# EAGLE design RFM69 USB Gateway 0.8 (EAGLE 7.6.0)
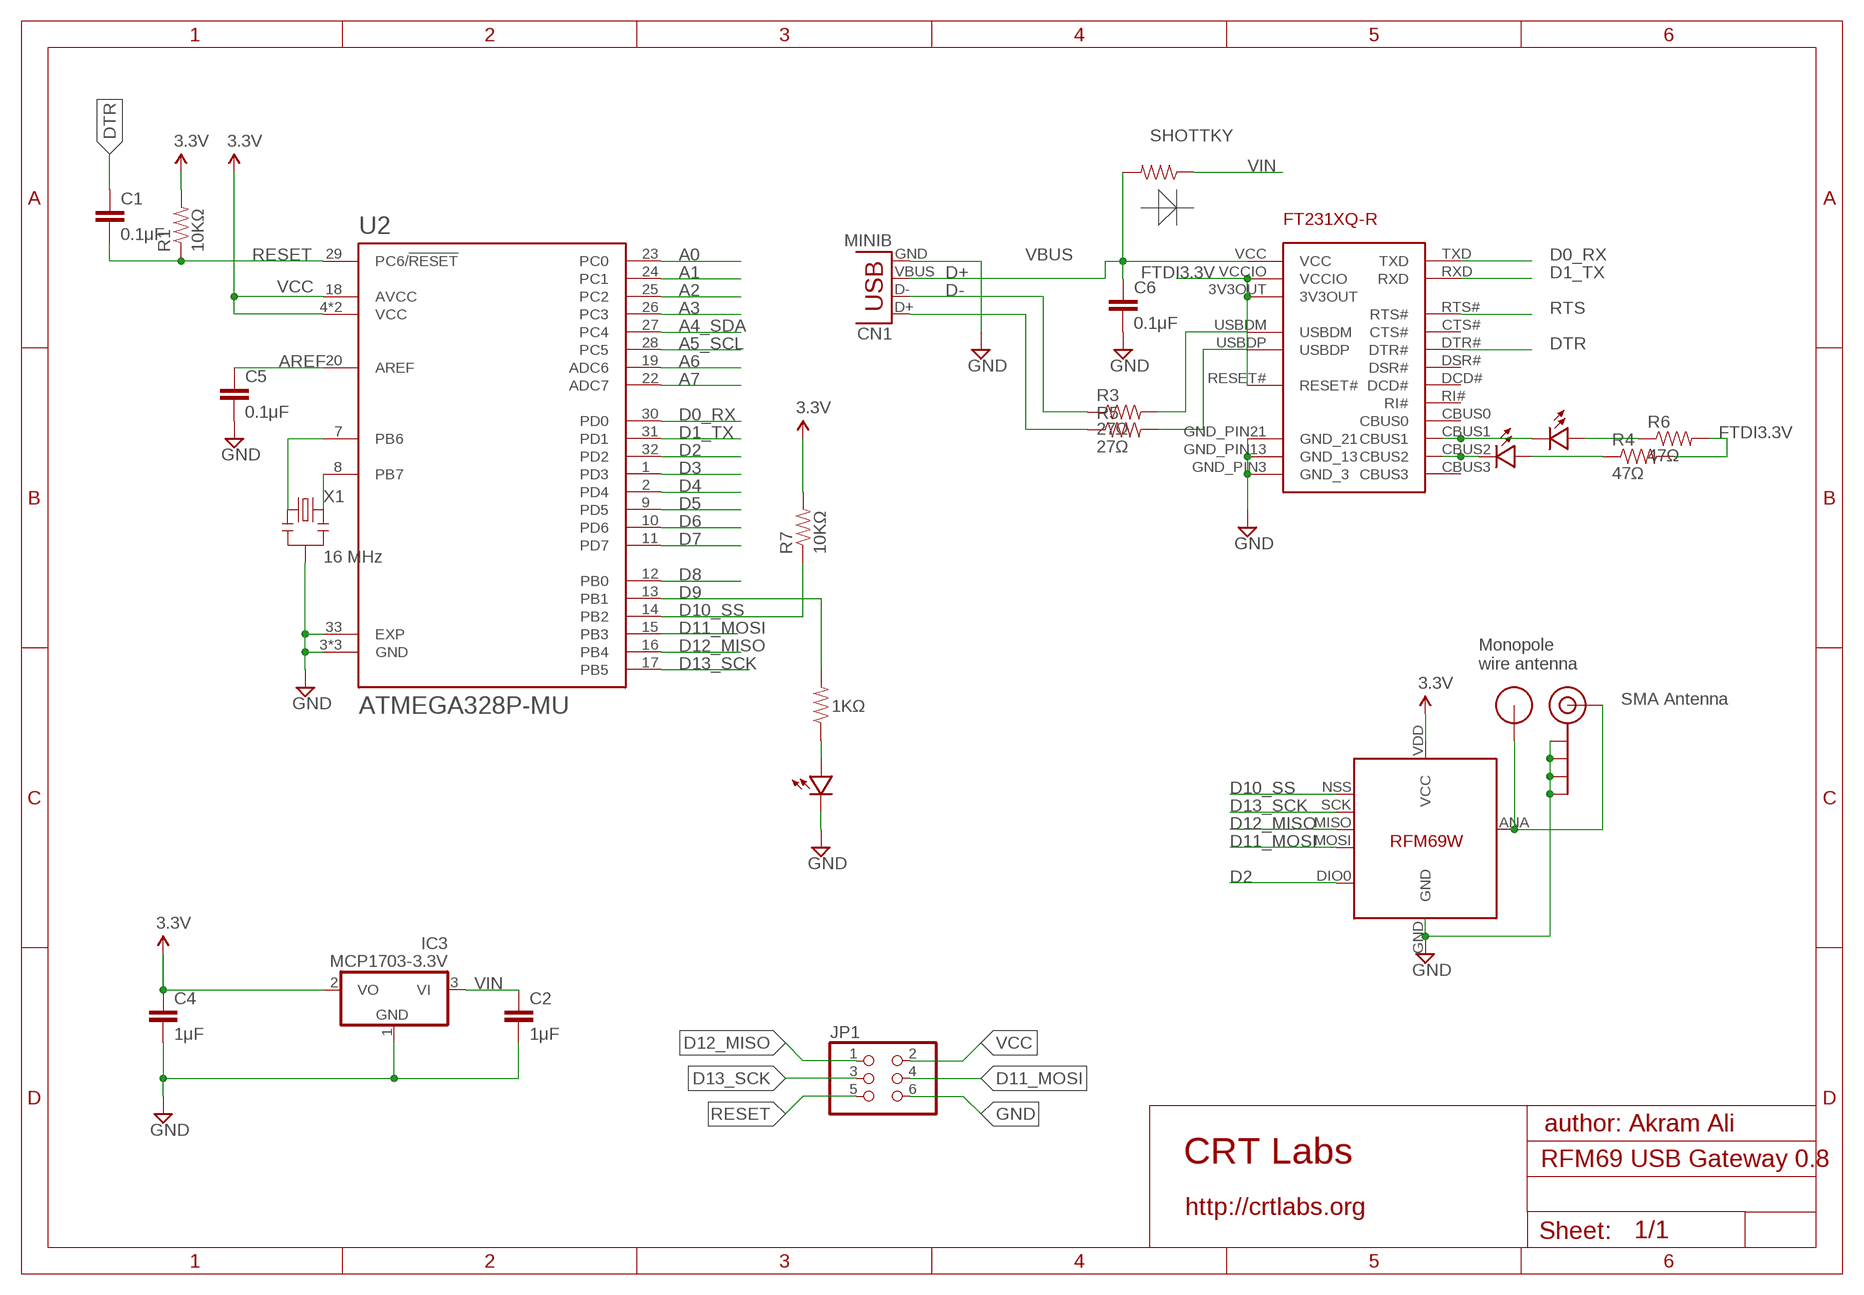
[diagram p0: schematic, sheet 1]

## Parts
C1  0.1μF  CAP0805  [0805]
C2  1μF  CAP0805  [0805]
C4  1μF  CAP0805  [0805]
C5  0.1μF  CAP0805  [0805]
C6  0.1μF  CAP0805  [0805]
CN1  MINIB  USB-A-H  [USB-A-H]
D  SHOTTKY  RESISTOR0805  [0805]
FT231XQ-R  FT231XQ-R  [FTDI_FT231XQ-R_PACKAGE]
IC3  MCP1703-3.3V  MCP1703CB  [SOT23]
J$1  SMA_EDGE  [SMA-EDGE]
JP1  PINHD-2X3  [2X03]
R1  10KΩ  RESISTOR0805  [0805]
R2  1KΩ  RESISTOR0805-RES  [0805]
R3  27Ω  RESISTOR0805-RES  [0805]
R4  47Ω  RESISTOR0805-RES  [0805]
R5  27Ω  RESISTOR0805-RES  [0805]
R6  47Ω  RESISTOR0805-RES  [0805]
R7  10KΩ  RESISTOR0805-RES  [0805]
RX  Green  LED0805  [0805-LED]
TX  Red  LED0805  [0805-LED]
U2  ATMEGA328P-MU  [QFN50P500X500X100-33N]
U$1  RFM12B_ANTENNA  [RFM12B-ANTENNA]
U$2  Status  LED0805  [0805-LED]
U$5  RFM69  [RFM69W-MINPADS]
X1  16 MHz  RESONATORSMD  [RESONATOR-SMD]

## Nets
A0: U2.23(PC0)
A1: U2.24(PC1)
A2: U2.25(PC2)
A3: U2.26(PC3)
A4_SDA: U2.27(PC4)
A5_SCL: U2.28(PC5)
A6: U2.19(ADC6)
A7: U2.22(ADC7)
AREF: C5.1 U2.20(AREF)
D0_RX: FT231XQ-R.TXD U2.30(PD0)
D1_TX: FT231XQ-R.RXD U2.31(PD1)
D2: U2.32(PD2) U$5.DIO0
D3: U2.1(PD3)
D4: U2.2(PD4)
D5: U2.9(PD5)
D6: U2.10(PD6)
D7: U2.11(PD7)
D8: U2.12(PB0)
D9: R2.2 U2.13(PB1)
D10_SS: R7.1 U2.14(PB2) U$5.NSS(SEL)
D11_MOSI: JP1.4 U2.15(PB3) U$5.MOSI
D12_MISO: JP1.1 U2.16(PB4) U$5.MISO
D13_SCK: JP1.3 U2.17(PB5) U$5.SCK
D+: CN1.D+ R5.1
D-: CN1.D- R3.1
DTR: C1.1 FT231XQ-R.DTR#
FTDI3.3V: FT231XQ-R.3V3OUT FT231XQ-R.RESET# FT231XQ-R.VCCIO R4.2 R6.2
GND [power]: C2.2 C4.2 C5.2 C6.2 CN1.GND FT231XQ-R.GND_PIN3(GND_3) FT231XQ-R.GND_PIN13(GND_13) FT231XQ-R.GND_PIN21(GND_21) IC3.1(GND) J$1.GND@0(GND) J$1.GND@1(GND) J$1.GND@2(GND) J$1.GND@3(GND) JP1.6 U2.3(GND) U2.5(GND) U2.21(GND) U2.33(EXP) U$2.MINUS U$5.GND X1.2
N$1: U2.7(PB6) X1.1
N$2: R2.1 U$2.PLUS
N$3: J$1.SIG(SIGNAL) U$1.P$1 U$5.ANA(ANT)
N$4: FT231XQ-R.USBDM R3.2
N$5: FT231XQ-R.USBDP R5.2
N$6: FT231XQ-R.CBUS1 RX.MINUS
N$7: FT231XQ-R.CBUS2 TX.MINUS
N$8: R4.1 TX.PLUS
N$9: R6.1 RX.PLUS
N$21: U2.8(PB7) X1.3
RESET: C1.2 JP1.5 R1.1 U2.29(PC6/!RESET)
RTS: FT231XQ-R.RTS#
VBUS [power]: C6.1 CN1.VBUS D.2 FT231XQ-R.VCC
VCC: C4.1 IC3.2(VO) JP1.2 R1.2 R7.2 U2.4(VCC) U2.6(VCC) U2.18(AVCC) U$5.VDD(VCC) ; supply symbol labelled 3.3V
VIN: C2.1 D.1 IC3.3(VI)
Unconnected: FT231XQ-R.CBUS0 FT231XQ-R.CBUS3 FT231XQ-R.CTS# FT231XQ-R.DCD# FT231XQ-R.DSR# FT231XQ-R.RI#

## Notes on the sheet
- Monopole
  wire antenna
- SMA Antenna
- author: Akram Ali
- CRT Labs
- http://crtlabs.org

## Library data of the parts
C1 C2 C5 C6 = SparkFun:CAP: Capacitor Standard 0603 ceramic capacitor, and 0.1" leaded capacitor.
C4 = LowPowerLab:CAP: Capacitor Standard 0603 ceramic capacitor, and 0.1" leaded capacitor.
CN1 = SparkFun-Connectors:USB: USB Connectors USB-B-PTH is fully proven SKU : PRT-00139/CONN-08278 USB-miniB is fully proven SKU : PRT-00587 USB-A-PCB is untested. USB-A-H is throughly reviewed, but untested. Spark Fun Electronics SKU : PRT-00437 USB-B-SMT is throughly reviewed, but untested. Needs silkscreen touching up. USB-A-S has not been used/tested USB-MB-H has not been used/tested USB-MICROB has been used. CONN-09505; PROD_ID: CONN-08367
D R1 = LowPowerLab:RESISTOR: Resistor Basic schematic elements and footprints for 0603, 1206, and PTH resistors.
FT231XQ-R = ftdi_ft231xq-r:FT231XQ-R: This is the 20-LD QFN package of the FTDI FT231XQ-R chip.
IC3 = linear:MCP1703: 250 mA, 16V, Low Quiescent Current LDO Regulator Source: http://ww1.microchip.com/downloads/en/DeviceDoc/22049b.pdf
J$1 = SparkFun-Connectors:SMA_EDGE: SMA Antenna Connector End launch SMA connector. The paste layer has been removed so that the connector can be hand soldered onto the board after reflow.
JP1 = pinhead:PINHD-2X3: PIN HEADER
R2-R7 = SparkFun:RESISTOR: Resistor Basic schematic elements and footprints for 0603, 1206, and PTH resistors.
RX TX U$2 = LowPowerLab:LED
U2 = ATMEGA328P-MU:ATMEGA328P-MU: ATmega Series 20 MHz 32 KB Flash 2 KB SRAM 8-Bit Microcontroller - QFN-32; AVAILABILITY: Good; DESCRIPTION: ATmega Series 20 MHz 32 KB Flash 2 KB SRAM 8-Bit Microcontroller - QFN-32; MF: Atmel; MP: ATMEGA328P-MU; PACKAGE: QFN-32 Atmel; PRICE: 2.55 USD
U$1 = LowPowerLab:RFM12B_ANTENNA
U$5 = LowPowerLab:RFM69
X1 = SparkFun:RESONATOR: Resonator Small SMD resonator. This is the itty bitty 10/20MHz resonators with built in caps. CSTCE10M0G55 and CSTCE20M0V53. Footprint has been reviewed closely but hasn't been tested yet.

## Net classes
1 power: width 0.381 mm, clearance 0.254 mm

## Board
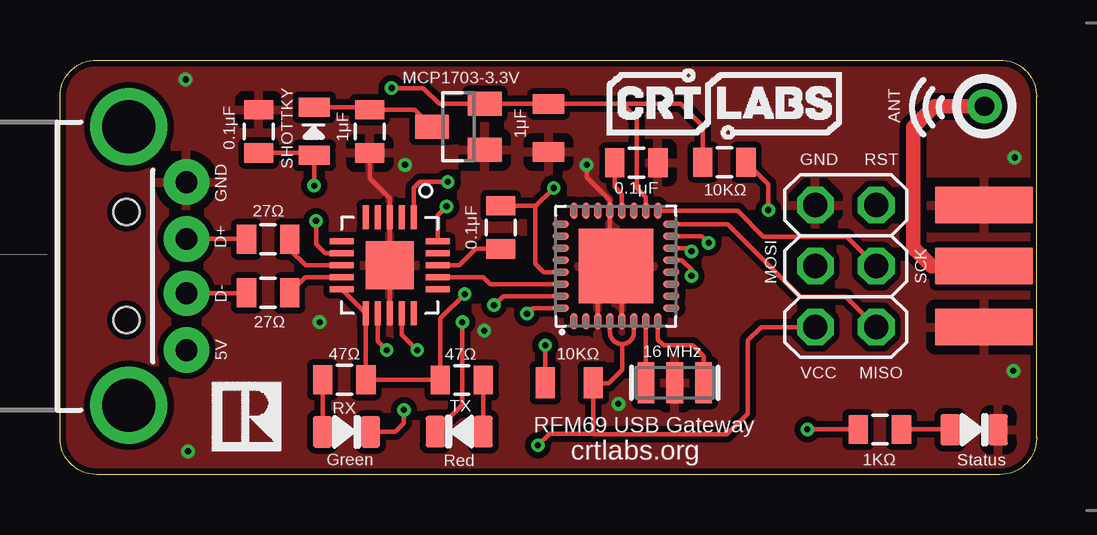
[diagram p1: board, top side]
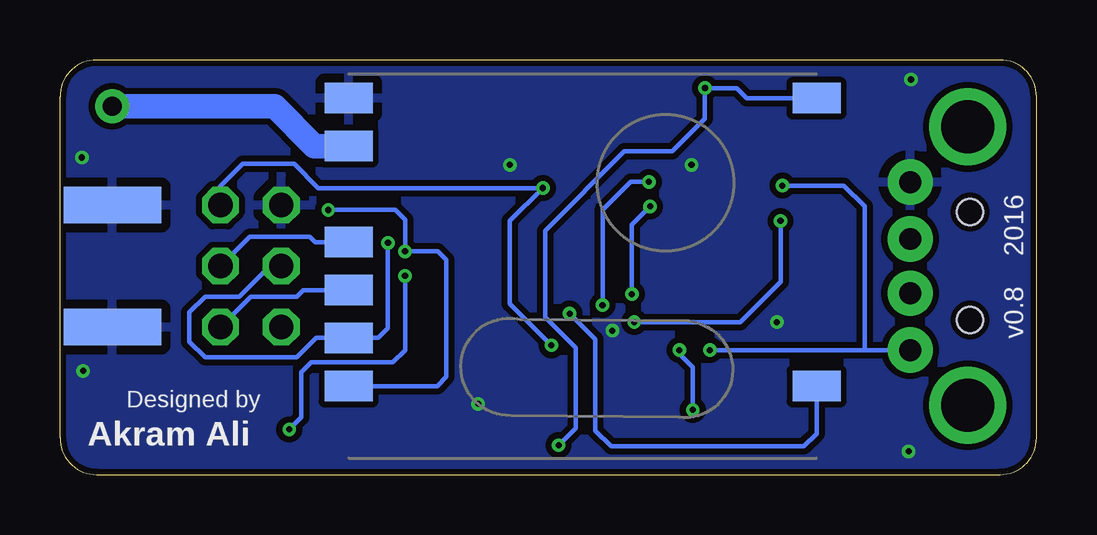
[diagram p2: board, bottom side, seen from below]

Size 40.69 x 17.27 mm. Coordinates in mm from the lower left corner, seen from the top.
Outline: 1.52,17.27 39.17,17.27 arc-90 40.69,15.75 40.69,1.52 arc-90 39.17,0 1.52,0 arc-90 0,1.52 0,15.75 arc-90 1.52,17.27
Copper layers (1*16): Top 0.035mm / dielectric 1.5mm / Bottom 0.035mm
Design rules "ITEADstudio_DRC *": minimum track width 6mil, minimum drill 12mil, track to track 6mil, track to pad 6mil, pad to pad 6mil, via to via 6mil, smd to smd 0mil, copper to edge 10mil, drill to drill 10mil, minimum pad ring 10mil, minimum via ring 6mil, stop-mask expansion 2mil, vias tented up to drill 100mil, thermal gap 15mil

### Footprints (pad centres in the part's own frame; a part is rotated, then mirrored left to right if it is on the bottom)
0805 = smd 0.8 x 1.2: 1 -0.9,0; 2 0.9,0
0805' = smd 0.8 x 1.3: 1 -1,0; 2 1,0
USB-A-H = drill 0.914 pad 1.88: D+ 2.4,1.127; D- 2.4,-1.127; GND 2.4,3.5; VBUS 2.4,-3.5 | drill 2.2: GND2 0,-5.8; GND3 0,5.8 | hole 1.1: -0.1,2.25; -0.1,-2.25
FTDI_FT231XQ-R_PACKAGE = smd 0.25 x 1: 3V3OUT 0.968,-2.032; CBUS2 -0.532,-2.032; CBUS3 0.968,1.968; CTS# -1.032,-2.032; DTR# -0.032,1.968; RTS# -0.532,1.968; TXD 0.468,1.968; USBDM 0.468,-2.032; USBDP -0.032,-2.032; VCCIO -1.032,1.968 | smd 1 x 0.25: CBUS0 1.968,0.968; CBUS1 1.968,0.468; DCD# -2.032,-1.032; DSR# -2.032,-0.532; GND_PIN3 -2.032,-0.032; GND_PIN13 1.968,-0.032; RESET# 1.968,-1.032; RI# -2.032,0.468; RXD -2.032,0.968; VCC 1.968,-0.532 | smd 2 x 2: GND_PIN21 -0.032,-0.032
SOT23 = smd 1 x 1.4: 1 -0.95,-1.1; 2 0.95,-1.1; 3 0,1.1
SMA-EDGE = smd 1.524 x 4.064: GND@0 0,0; GND@1 5.08,0; SIG 2.54,0 | smd 1.524 x 4.064 bottom: GND@2 0,0; GND@3 5.08,0
2X03 = drill 1.016 octagon: 1 -2.54,-1.27; 2 -2.54,1.27; 3 0,-1.27; 4 0,1.27; 5 2.54,-1.27; 6 2.54,1.27
0805-LED = smd 0.8 x 1.3: MINUS -1,0; PLUS 1,0
QFN50P500X500X100-33N = smd 0.7 x 0.3: 1 -2.3,1.75; 2 -2.3,1.25; 3 -2.3,0.75; 4 -2.3,0.25; 5 -2.3,-0.25; 6 -2.3,-0.75; 7 -2.3,-1.25; 8 -2.3,-1.75; 17 2.3,-1.75; 18 2.3,-1.25; 19 2.3,-0.75; 20 2.3,-0.25; 21 2.3,0.25; 22 2.3,0.75; 23 2.3,1.25; 24 2.3,1.75 | smd 0.3 x 0.7: 9 -1.75,-2.3; 10 -1.25,-2.3; 11 -0.75,-2.3; 12 -0.25,-2.3; 13 0.25,-2.3; 14 0.75,-2.3; 15 1.25,-2.3; 16 1.75,-2.3; 25 1.75,2.3; 26 1.25,2.3; 27 0.75,2.3; 28 0.25,2.3; 29 -0.25,2.3; 30 -0.75,2.3; 31 -1.25,2.3; 32 -1.75,2.3 | smd 3.1 x 3.1: 33 0,0
RFM12B-ANTENNA = drill 0.8 pad 1.422: P$1 0,0
RFM69W-MINPADS = smd 2 x 1.27: ANA 8,-5; DIO0 -11.5,5; GND 8,-7; MISO 8,1; MOSI 8,3; NSS 8,5; SCK 8,-1; VDD -11.5,-7
RESONATOR-SMD = smd 0.7 x 1.7: 1 -1.2,0; 2 0,0; 3 1.2,0

### Placement (x,y rotation side)
C1  18.36,10.3 90 top
C2  12.9,14.3 270 top
C4  1μF  [0805']  20.36,14.44 270 top
C5  24.02,12.99 0 top
C6  8.28,14.3 90 top
CN1  2.87,8.69 0 top
D  SHOTTKY  [0805']  10.59,14.3 270 top
FT231XQ-R  13.77,8.69 270 top
IC3  16.6,14.49 90 top
J$1  38.51,6.15 90 top
JP1  32.74,8.69 90 top
R1  10KΩ  [0805']  21.22,3.82 0 top
R2  34.16,1.88 180 top
R3  8.67,7.57 0 top
R4  16.74,3.94 180 top
R5  8.67,9.8 0 top
R6  11.85,3.95 0 top
R7  27.69,13.02 180 top
RX  11.94,1.78 180 top
TX  16.64,1.79 0 top
U2  23.16,8.69 90 top
U$1  38.52,15.34 0 top
U$2  38.09,1.87 180 top
U$5  20.66,8.69 180 bottom
X1  25.62,3.82 0 top

### Tracks (layer width: path | path; a pad name or v marks a point on that pad's centre or on a via)
AREF
  Top 0.178: U2.20 23.41,11.69 23.11,11.99 C5.1
D0_RX
  Top 0.178: U2.30 17.92,7.94 17.64,8.22 FT231XQ-R.TXD
D1_TX  (via drill 0.25 pad 0.13)
  Top 0.178: U2.31 18.46,7.44 v18.08,7.06 | FT231XQ-R.RXD 14.73,11.94 14.99,12.19 v16.15,12.19
  Bottom 0.178: v18.08,7.06 18.08,11.02 16.92,12.19 v16.15,12.19
D2  (via drill 0.25 pad 0.13)
  Top 0.178: U2.32 19.69,6.94 v19.46,6.71
  Bottom 0.178: U$5.DIO0 9.16,1.71 9.7,1.17 17.73,1.17 18.39,1.83 18.39,5.64 v19.46,6.71
D9  (via drill 0.25 pad 0.13)
  Top 0.178: U2.13 25.91,8.94 26.31,8.53 v26.31,8.28 | v31.14,1.88 R2.2
  Bottom 0.178: v26.31,8.28 26.31,5.18 26.82,4.67 30.23,4.67 30.63,4.27 30.63,2.39 v31.14,1.88
D10_SS  (via drill 0.25 pad 0.13)
  Top 0.178: U2.14 26.17,9.44 v26.31,9.3 | R7.1 29.51,12.09 v29.51,11.02
  Bottom 0.178: U$5.NSS 24.96,3.69 24.59,4.06 24.59,8.94 24.94,9.3 v26.31,9.3 26.31,10.62 26.72,11.02 v29.51,11.02
D11_MOSI  (via drill 0.25 pad 0.13)
  Top 0.178: U2.15 26.74,9.94 v27.03,9.65
  Bottom 0.178: JP1.4 31.95,8.69 33.22,7.42 34.65,7.42 35.31,6.76 35.31,5.54 34.65,4.88 30.84,4.88 30.02,5.69 U$5.MOSI 27.43,5.69 27.03,6.1 v27.03,9.65
D12_MISO
  Top 0.178: U2.16 27.82,10.44 30.84,7.42 32.74,7.42 JP1.1
  Bottom 0.178: U$5.MISO 30.57,7.69 30.84,7.42 32.74,7.42 JP1.1
D13_SCK
  Top 0.178: JP1.3 32.79,9.91 29.31,9.91 28.23,10.99 U2.17
  Bottom 0.178: U$5.SCK 30.06,9.69 30.28,9.91 32.79,9.91 JP1.3
D+
  Top 0.178: CN1.D+ R5.1
D-
  Top 0.178: CN1.D- R3.1
DTR
  Top 0.178: FT231XQ-R.DTR# 16.64,8.72 17.32,9.4 C1.1
FTDI3.3V  (via drill 0.25 pad 0.13)
  Top 0.178: FT231XQ-R.3V3OUT FT231XQ-R.RESET# 12.73,3.96 R6.2 15.83,3.95 R4.2 15.85,3.95 15.85,6.5 v16.87,7.52 | FT231XQ-R.VCCIO 15.73,10.81 v16.1,11.18
  Bottom 0.178: v16.87,7.52 16.87,10.41 v16.1,11.18
GND  (via drill 0.25 pad 0.13)
  Top 0.178: FT231XQ-R.GND_PIN13 FT231XQ-R.GND_PIN21 FT231XQ-R.GND_PIN3 13.73,11.51 12.9,12.34 C2.2 | U2.33 22.91,8.94 U2.21 22.91,11.43 21.95,12.4 v21.95,12.9 | U2.5 23.41,8.44 U2.33 | U2.3 22.41,7.94 U2.33
  other vias: 23.27,2.95 17.68,5.99 14.38,12.9 5.23,16.46 5.33,0.97 39.73,4.32 39.78,13.21 10.82,6.35
  pour Bottom: -1.04,21.11 -1.04,-3.66 41.63,-3.54 41.63,21.22
  pour Top: -0.36,21.07 -0.36,-3.7 41.48,-3.62 41.48,21.15
N$1
  Top 0.178: U2.7 X1.1
N$2
  Top 0.178: R2.1 37.07,1.88 U$2.PLUS
N$3
  Top 0.61: J$1.SIG 36.32,8.69 35.56,9.45 35.56,14.48 36.42,15.34 U$1.P$1
  Bottom 1.016: U$5.ANA 30.1,13.69 31.75,15.34 U$1.P$1
N$4
  Top 0.178: FT231XQ-R.USBDM 10.22,8.22 R3.2
N$5
  Top 0.178: FT231XQ-R.USBDP 10.23,8.72 9.57,9.37 R5.2
N$6  (via drill 0.25 pad 0.13)
  Top 0.178: FT231XQ-R.CBUS1 14.23,5.83 v14.88,5.18 | RX.MINUS 13.97,1.78 14.33,2.13 v14.33,2.69
  Bottom 0.178: v14.88,5.18 14.88,5.03 14.33,4.47 v14.33,2.69
N$7  (via drill 0.25 pad 0.13)
  Top 0.178: FT231XQ-R.CBUS2 11.05,9.22 10.67,9.6 v10.67,10.57 | TX.MINUS 16.76,2.92 v16.76,6.35
  Bottom 0.178: v10.67,10.57 10.67,8.03 12.34,6.35 v16.76,6.35
N$8
  Top 0.178: TX.PLUS R4.1
N$9
  Top 0.178: R6.1 10.95,1.79 RX.PLUS
N$21
  Top 0.178: U2.8 24.91,5.62 25.15,5.38 26.37,5.38 26.82,4.93 X1.3
RESET  (via drill 0.25 pad 0.13)
  Top 0.178: U2.29 20.16,8.44 19.81,8.79 19.81,11.18 | C1.2 19.79,11.2 19.81,11.18 | R1.1 v20.22,5.38 | 19.81,11.18 v20.57,11.94
  Bottom 0.178: JP1.5 34.01,12.01 33.07,12.95 30.94,12.95 29.92,11.94 v20.57,11.94 21.95,10.57 21.95,7.11 v20.22,5.38
VBUS  (via drill 0.25 pad 0.13)
  Top 0.178: C6.1 10.49,13.4 D.2 v10.59,12.04 | FT231XQ-R.VCC 13.23,5.56 v13.61,5.18
  Bottom 0.178: v13.61,5.18 7.16,5.18 | 7.16,5.18 CN1.VBUS | v10.59,12.04 8.03,12.04 7.16,11.18 7.16,5.18
VCC  (via drill 0.25 pad 0.13)
  Top 0.178: U2.18 24.41,11.55 24.03,11.94 24.03,14.83 23.42,15.44 | 23.42,15.44 C4.1 IC3.2 15.8,15.44 15.14,16.1 v13.82,16.1 | R7.2 26.79,14.51 25.86,15.44 23.42,15.44 | R1.2 | U2.4 22.91,5.94 arc90 23.42,5.44 | 23.42,5.44 arc90 23.91,5.93 U2.6 23.91,5.83 | 23.42,5.44 23.42,4.37 22.86,3.81 22.23,3.81 R1.2 | JP1.2 29.21,6.15 28.65,5.59 28.65,2.54 27.79,1.68 22.25,1.68 22.22,1.7 | 22.22,1.7 R1.2 | 22.22,1.7 20.4,1.7 v19.91,1.22
  Bottom 0.178: U$5.VDD 12.08,15.69 12.5,16.1 v13.82,16.1 13.82,14.83 15.19,13.46 17.17,13.46 20.47,10.16 20.47,6.55 19.2,5.28 19.2,1.93 v19.91,1.22
VIN
  Top 0.178: D.1 12.8,15.3 C2.1 14.79,15.2 IC3.3

### Text on the board
tPlace: ANT | RFM69 USB Gateway | crtlabs.org
bPlace: v0.8 2016 | Designed by | Akram Ali
tDocu: All dimensions in mils | Moteino-USB
_tsilk: GND | GND | RST | D+ | SCK | MOSI | D- | 5V | VCC | MISO